# EAGLE design pogo (EAGLE 6.1)
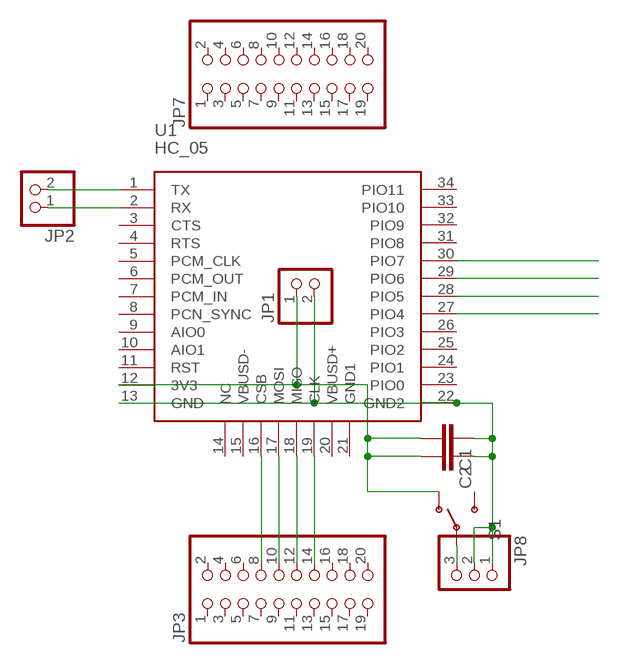
[diagram p0: schematic, sheet 1]

## Parts
C1  C-EUC0805  [C0805]
C2  C-EUC0805  [C0805]
JP1  PINHD-1X2  [1X02]
JP2  PINHD-1X2  [1X02]
JP3  PINHD-2X10  [2X10]
JP7  PINHD-2X10  [2X10]
JP8  PINHD-1X3  [1X03]
S1  SWITCH-SPDT-SMD-A  [SWITCH-SPST-SMD-A]
U1  HC_05  [BLUETOOTH_SMD]

## Nets
N$1: JP8.3 S1.2(P)
N$3: C1.2 C2.2 JP1.1 S1.1(O) U1.12(3V3)
N$4: C1.1 C2.1 JP1.2 JP8.1 JP8.2 U1.13(GND) U1.22(GND2)
N$7: JP2.1 U1.2(RX)
N$8: JP2.2 U1.1(TX)
N$9: U1.30(PIO7)
N$10: U1.29(PIO6)
N$11: U1.28(PIO5)
N$12: U1.27(PIO4)
N$29: JP3.8 U1.16(CSB)
N$30: JP3.10 U1.17(MOSI)
N$31: JP3.12 U1.18(MISO)
N$32: JP3.14 U1.19(CLK)
Unconnected: JP3.1 JP3.2 JP3.3 JP3.4 JP3.5 JP3.6 JP3.7 JP3.9 JP3.11 JP3.13 JP3.15 JP3.16 JP3.17 JP3.18 JP3.19 JP3.20 JP7.1 JP7.2 JP7.3 JP7.4 JP7.5 JP7.6 JP7.7 JP7.8 JP7.9 JP7.10 JP7.11 JP7.12 JP7.13 JP7.14 JP7.15 JP7.16 JP7.17 JP7.18 JP7.19 JP7.20 S1.3(S) U1.3(CTS) U1.4(RTS) U1.5(PCM_CLK) U1.6(PCM_OUT) U1.7(PCM_IN) U1.8(PCN_SYNC) U1.9(AIO0) U1.10(AIO1) U1.11(RST) U1.14(NC) U1.15(VBUSD-) U1.20(VBUSD+) U1.21(GND1) U1.23(PIO0) U1.24(PIO1) U1.25(PIO2) U1.26(PIO3) U1.31(PIO8) U1.32(PIO9) U1.33(PIO10) U1.34(PIO11)

## Library data of the parts
C1 C2 = rcl:C-EU: CAPACITOR, European symbol
JP1 JP2 = pinhead:PINHD-1X2: PIN HEADER
JP3 JP7 = pinhead:PINHD-2X10: PIN HEADER
JP8 = pinhead:PINHD-1X3: PIN HEADER
S1 = SparkFun-Electromechanical:SWITCH-SPDT: SPDT Switch Simple slide switch, Spark Fun Electronics SKU : COM-00102 DPDT SMT slide switch, AYZ0202, SWCH-08179
U1 = SerialPortBluetooth:HC_05

## Board
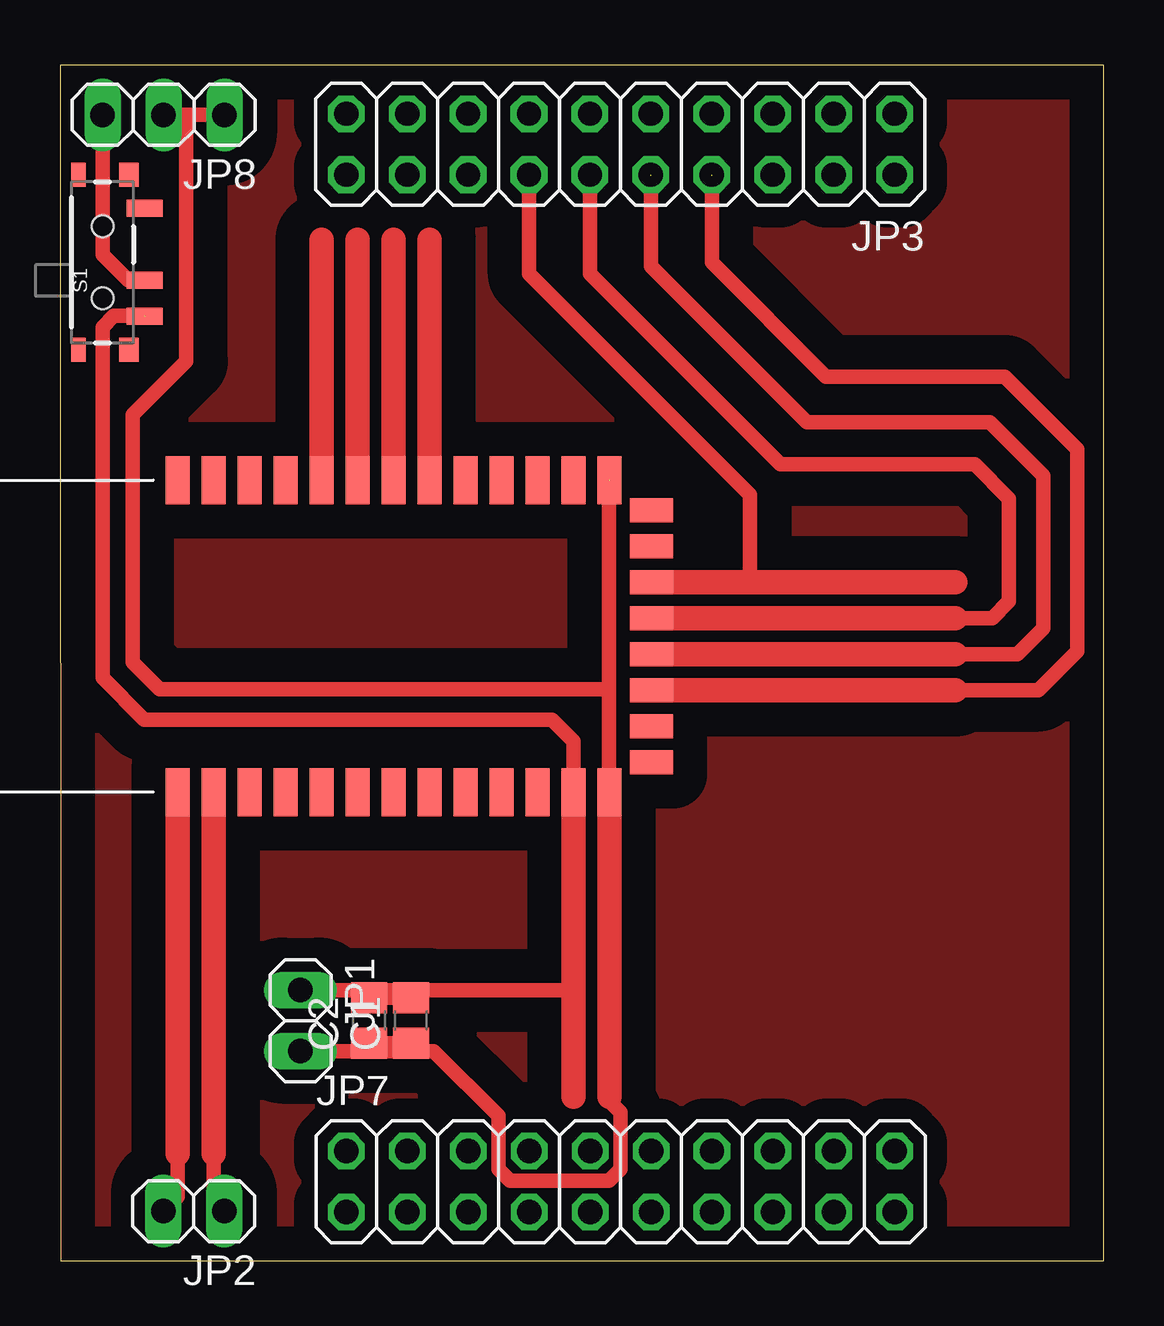
[diagram p1: board, top side]

Size 43.52 x 49.81 mm. Coordinates in mm from the lower left corner, seen from the top.
Outline: 0.03,0 43.52,0 43.52,49.81 0,49.81 0.03,0
Copper layers (1*16): Top 0.035mm / dielectric 1.5mm / Bottom 0.035mm
Design rules: minimum track width 10mil, minimum drill 24mil, track to track 8mil, track to pad 8mil, pad to pad 8mil, via to via 8mil, smd to smd 8mil, copper to edge 40mil, drill to drill 8mil, minimum pad ring 10mil, minimum via ring 8mil, stop-mask expansion 4mil, vias tented up to drill 0mil, thermal gap 10mil

### Footprints (pad centres in the part's own frame; a part is rotated, then mirrored left to right if it is on the bottom)
C0805 = smd 1.3 x 1.5: 1 -0.95,0; 2 0.95,0
1X02 = drill 1.016 long: 1 -1.27,0; 2 1.27,0
2X10 = drill 1.016 octagon: 1 -11.43,-1.27; 2 -11.43,1.27; 3 -8.89,-1.27; 4 -8.89,1.27; 5 -6.35,-1.27; 6 -6.35,1.27; 7 -3.81,-1.27; 8 -3.81,1.27; 9 -1.27,-1.27; 10 -1.27,1.27; 11 1.27,-1.27; 12 1.27,1.27; 13 3.81,-1.27; 14 3.81,1.27; 15 6.35,-1.27; 16 6.35,1.27; 17 8.89,-1.27; 18 8.89,1.27; 19 11.43,-1.27; 20 11.43,1.27
1X03 = drill 1.016 long: 1 -2.54,0; 2 0,0; 3 2.54,0
SWITCH-SPST-SMD-A = smd 0.7 x 1.5: 1 -2.25,-1.75; 2 -0.75,-1.75; 3 2.25,-1.75 | smd 1 x 0.6: GND1 -3.65,1; GND3 3.65,1 | smd 1 x 0.8: GND2 -3.65,-1.1; GND4 3.65,-1.1 | hole 0.9: -1.5,0; 1.5,0
BLUETOOTH_SMD = smd 2 x 1: 1 0,0; 2 0,-1.5; 3 0,-3; 4 0,-4.5; 5 0,-6; 6 0,-7.5; 7 0,-9; 8 0,-10.5; 9 0,-12; 10 0,-13.5; 11 0,-15; 12 0,-16.5; 13 0,-18; 22 13,-18; 23 13,-16.5; 24 13,-15; 25 13,-13.5; 26 13,-12; 27 13,-10.5; 28 13,-9; 29 13,-7.5; 30 13,-6; 31 13,-4.5; 32 13,-3; 33 13,-1.5; 34 13,0 | smd 1 x 1.8: 14 1.25,-19.75; 15 2.75,-19.75; 16 4.25,-19.75; 17 5.75,-19.75; 18 7.25,-19.75; 19 8.75,-19.75; 20 10.25,-19.75; 21 11.75,-19.75

### Placement (x,y rotation side)
C1  14.63,10 90 top
C2  12.88,10 90 top
JP1  10.03,10 270 top
JP2  5.58,2.06 180 top
JP3  23.36,46.51 180 top
JP7  23.37,3.29 0 top
JP8  4.32,47.74 180 top
S1  1.77,41.59 90 top
U1  4.9,19.52 90 top

### Tracks (layer width: path | path; a pad name or v marks a point on that pad's centre or on a via)
N$1
  Top 0.61: JP8.3 1.78,41.92 1.77,41.91 2.84,40.84 S1.2
N$2
  pour Top (isolate 1.422, no thermals): 0.03,0 43.52,0 43.52,49.85 0.03,49.85
N$3  (1 unrouted)
  Top 0.61: 3.55,39.37 S1.1 | U1.12 21.4,21.64 20.5,22.54 3.52,22.54 1.77,24.29 1.77,38.89 2.25,39.37 3.52,39.37 | 21.46,11.27 21.4,11.27 JP1.1 12.56,11.27 C2.2 C1.2
  Top 1.016: U1.12 21.4,11.27 21.4,6.83
N$4  (1 unrouted)
  Top 0.61: 22.89,23.81 4.15,23.81 3.04,24.92 3.04,35.24 5.26,37.47 5.26,47.62 5.15,47.74 JP8.2 JP8.1 | 22.89,23.81 22.89,32.54 | 22.89,23.81 22.89,19.54 U1.13 | 22.9,6.83 22.89,6.83 22.89,6.67 23.36,6.19 23.36,3.81 22.89,3.33 18.76,3.33 18.28,3.81 18.28,6.03 15.58,8.73 14.95,8.73 | 14.95,8.73 JP1.2 | 14.95,8.73 C1.1 C2.1
  Top 1.016: U1.13 22.9,6.83
N$7
  Top 0.61: 6.4,4.45 6.4,2.51 JP2.1
  Top 1.016: U1.2 6.4,4.45
N$8
  Top 0.61: 4.9,4.45 4.9,2.65 JP2.2
  Top 1.016: U1.1 4.9,4.45
N$9
  Top 1.016: U1.30 10.9,42.55
N$10
  Top 1.016: U1.29 12.4,42.55
N$11
  Top 1.016: U1.28 13.9,42.55
N$12
  Top 1.016: U1.27 15.4,42.55
N$29  (1 unrouted)
  Top 0.61: 37.33,23.77 40.78,23.77 42.41,25.4 42.41,33.81 39.4,36.83 31.93,36.83 27.17,41.59 27.17,45.19
  Top 1.016: U1.16 37.33,23.77
N$30  (1 unrouted)
  Top 0.61: 37.33,25.27 39.9,25.27 40.98,26.35 40.98,32.7 38.76,34.92 31.14,34.92 24.63,41.43 24.63,45.19
  Top 1.016: U1.17 37.33,25.27
N$31
  Top 0.61: 37.33,26.77 38.86,26.77 39.55,27.46 39.55,31.75 38.13,33.18 30.03,33.18 22.09,41.12 JP3.12
  Top 1.016: U1.18 37.33,26.77
N$32
  Top 0.61: 28.76,28.27 28.76,31.91 19.56,41.11 JP3.14
  Top 1.016: U1.19 28.76,28.27 37.33,28.27